# EAGLE schematic Esquemático (EAGLE 8.4.0)
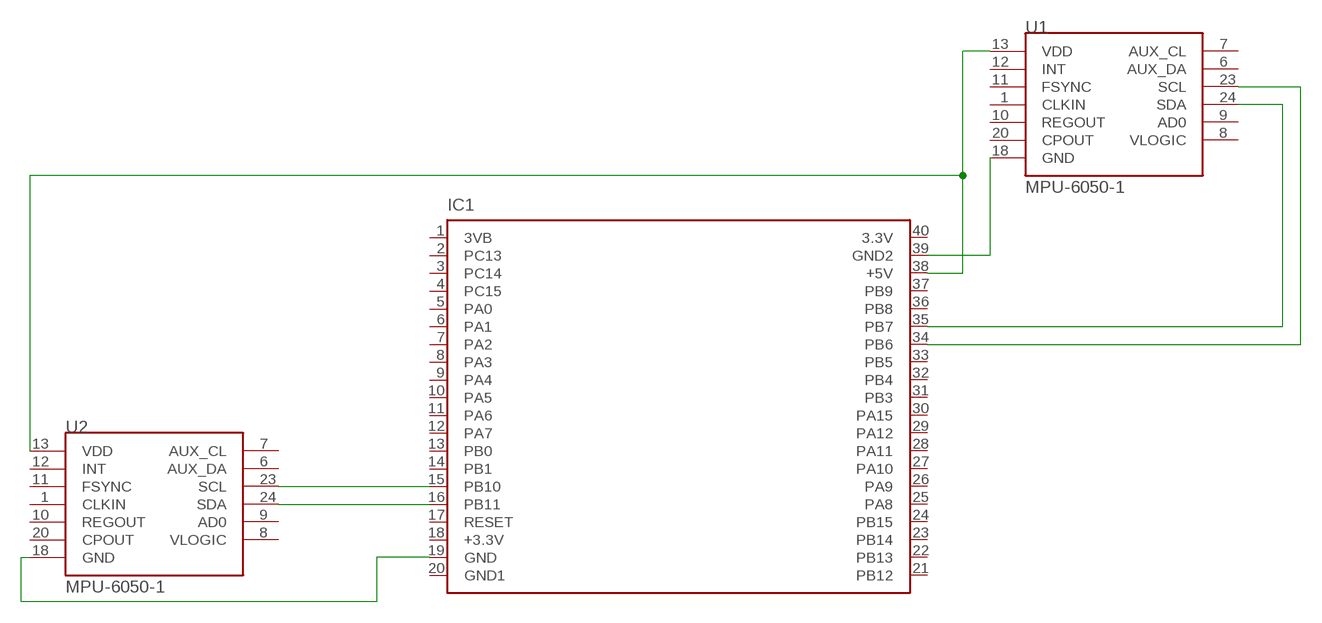
[diagram p0: schematic, sheet 1]

## Parts
IC1  BLUEPILL550  [DIL40]
U1  MPU-6050-1  [QFN-24-4MM2]
U2  MPU-6050-1  [QFN-24-4MM2]

## Nets
N$1: IC1.15(PB10) U2.23(SCL)
N$2: IC1.35(PB7) U1.24(SDA)
N$3: IC1.34(PB6) U1.23(SCL)
N$4: IC1.16(PB11) U2.24(SDA)
N$5: IC1.38(+5V) U1.13(VDD) U2.13(VDD)
N$6: IC1.39(GND2) U1.18(GND)
N$7: IC1.19(GND) U2.18(GND)
Unconnected: IC1.1(3VB) IC1.2(PC13) IC1.3(PC14) IC1.4(PC15) IC1.5(PA0) IC1.6(PA1) IC1.7(PA2) IC1.8(PA3) IC1.9(PA4) IC1.10(PA5) IC1.13(PB0) IC1.14(PB1) IC1.17(RESET) IC1.18(+3.3V) IC1.20(GND1) IC1.21(PB12) IC1.22(PB13) IC1.23(PB14) IC1.24(PB15) IC1.25(PA8) IC1.26(PA9) IC1.27(PA10) IC1.28(PA11) IC1.29(PA12) IC1.30(PA15) IC1.33(PB5) IC1.36(PB8) IC1.37(PB9) IC1.40(3.3V) U1.1(CLKIN) U1.6(AUX_DA) U1.7(AUX_CL) U1.8(VLOGIC) U1.9(AD0) U1.10(REGOUT) U1.11(FSYNC) U1.12(INT) U1.20(CPOUT) U2.1(CLKIN) U2.6(AUX_DA) U2.7(AUX_CL) U2.8(VLOGIC) U2.9(AD0) U2.10(REGOUT) U2.11(FSYNC) U2.12(INT) U2.20(CPOUT)

## Power pins joined to a net without a drawn wire
PA6: IC1.11(PA6)
PA7: IC1.12(PA7)
PB3: IC1.31(PB3)
PB4: IC1.32(PB4)

## Library data of the parts
IC1 = STM32BluePill:BLUEPILL: BluePill STM32F108T6 Dev Board Source: http://www.stm32duino.com; 0: x; BLUEP: 1; MF: BluePill; MPN: BluePill; X: 0
U1 U2 = Testing:MPU-6050